# Altium schematic sheet MFX.SchDoc: MFX
size A4; DocumentNumber: MB1167; Revision: B.1; SheetNumber: 16; SheetTotal: 17; Project: STM327x6G-EVAL
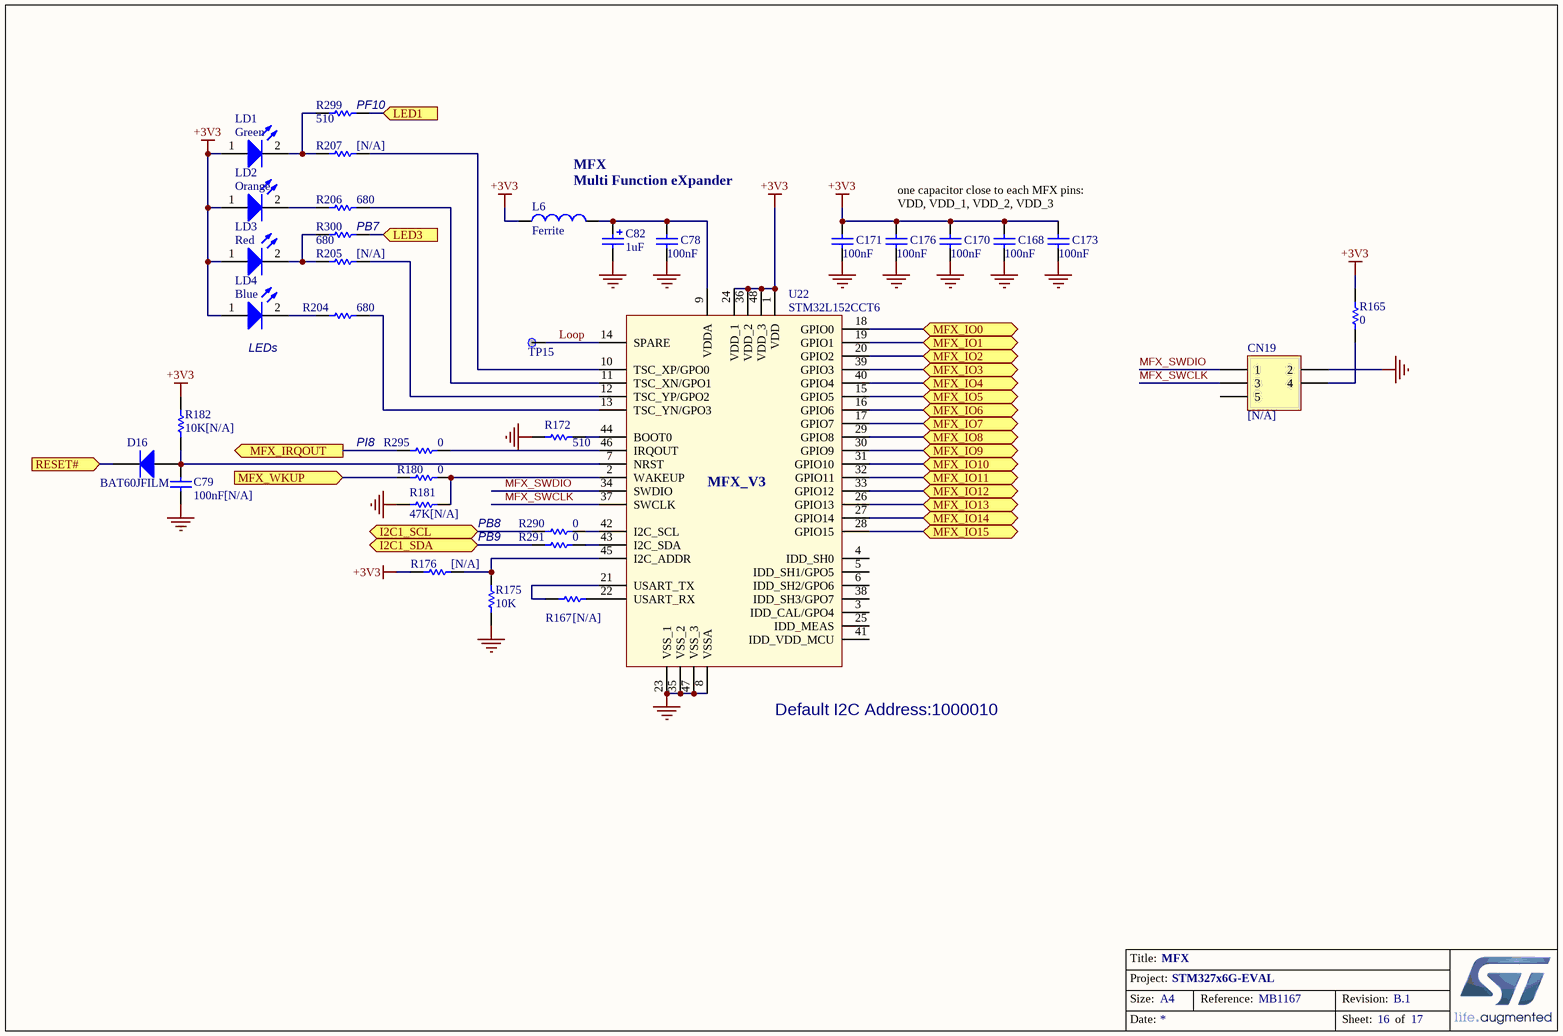
[diagram p0: MFX.SchDoc]

## Parts
C78  100nF  [0402C]
C79  100nF[N/A]  [0402C]
C82  1uF  [TAN-A]
C168  100nF  [0402C]
C170  100nF  [0402C]
C171  100nF  [0402C]
C173  100nF  [0402C]
C176  100nF  [0402C]
CN19  [N/A]  [HDR_2X3-1_2R54-6]
D16  BAT60JFILM  [SOD-323]
L6  Ferrite  [0603L]
LD1  Green  [0603D]
LD2  Orange  [0603D]
LD3  Red  [0603D]
LD4  Blue  [0603D]
R165  0  [0603R]
R167  [N/A]  [0603R]
R172  510  [0402R]
R175  10K  [0402R]
R176  [N/A]  [0603R]
R180  0  [0603R]
R181  47K[N/A]  [0402R]
R182  10K[N/A]  [0402R]
R204  680  [0603R]
R205  [N/A]  [0603R]
R206  680  [0603R]
R207  [N/A]  [0603R]
R290  0  [0603R]
R291  0  [0603R]
R295  0  [0603R]
R299  510  [0603R]
R300  680  [0603R]
TP15  (no value)  [TP]
U22  STM32L152CCT6  [LQFP48_0R5_9X9]

## Ports
I2C1_SCL (bidir), I2C1_SDA (bidir), LED1 (in), LED3 (in), MFX_IO0 (bidir), MFX_IO1 (bidir), MFX_IO2 (bidir), MFX_IO3 (bidir), MFX_IO4 (bidir), MFX_IO5 (bidir), MFX_IO6 (bidir), MFX_IO7 (bidir), MFX_IO8 (bidir), MFX_IO9 (bidir), MFX_IO10 (bidir), MFX_IO11 (bidir), MFX_IO12 (bidir), MFX_IO13 (bidir), MFX_IO14 (bidir), MFX_IO15 (bidir), MFX_IRQOUT (out), MFX_WKUP (in), RESET# (in)

## Nets
+3V3: C168.2 C170.1 C171.2 C173.2 C176.2 L6.1 LD1.1(A) LD2.1(A) LD3.1(A) LD4.1(A) R165.1 R176.2 R182.2 U22.1(VDD) U22.24(VDD_1) U22.36(VDD_2) U22.48(VDD_3)
GND: C78.1 C79.1 C82.2 C168.1 C170.2 C171.1 C173.1 C176.1 CN19.2 R172.2 R175.2 R181.1 U22.8(VSSA) U22.23(VSS_1) U22.35(VSS_2) U22.47(VSS_3)
I2C1_SCL: R290.1 ; port I2C1_SCL
I2C1_SDA: R291.1 ; port I2C1_SDA
LED1: R299.1 ; port LED1
LED3: R300.1 ; port LED3
Loop: TP15.1 U22.14(SPARE)
MFX_IO0: U22.18(GPIO0) ; port MFX_IO0
MFX_IO1: U22.19(GPIO1) ; port MFX_IO1
MFX_IO2: U22.20(GPIO2) ; port MFX_IO2
MFX_IO3: U22.39(GPIO3) ; port MFX_IO3
MFX_IO4: U22.40(GPIO4) ; port MFX_IO4
MFX_IO5: U22.15(GPIO5) ; port MFX_IO5
MFX_IO6: U22.16(GPIO6) ; port MFX_IO6
MFX_IO7: U22.17(GPIO7) ; port MFX_IO7
MFX_IO8: U22.29(GPIO8) ; port MFX_IO8
MFX_IO9: U22.30(GPIO9) ; port MFX_IO9
MFX_IO10: U22.31(GPIO10) ; port MFX_IO10
MFX_IO11: U22.32(GPIO11) ; port MFX_IO11
MFX_IO12: U22.33(GPIO12) ; port MFX_IO12
MFX_IO13: U22.26(GPIO13) ; port MFX_IO13
MFX_IO14: U22.27(GPIO14) ; port MFX_IO14
MFX_IO15: U22.28(GPIO15) ; port MFX_IO15
MFX_IRQOUT: R295.1 ; port MFX_IRQOUT
MFX_SWCLK: CN19.3 U22.37(SWCLK)
MFX_SWDIO: CN19.1 U22.34(SWDIO)
MFX_WKUP: R180.2 ; port MFX_WKUP
RESET#: D16.2(K) ; port RESET#
NetC78_2: C78.2 C82.1 L6.2 U22.9(VDDA)
NetC79_2: C79.2 D16.1(A) R182.1 U22.7(NRST)
NetCN19_4: CN19.4 R165.2
NetLD1_2: LD1.2(K) R207.2 R299.2
NetLD2_2: LD2.2(K) R206.2
NetLD3_2: LD3.2(K) R205.2 R300.2
NetLD4_2: LD4.2(K) R204.2
NetR167_1: R167.1 U22.21(USART_TX)
NetR167_2: R167.2 U22.22(USART_RX)
NetR172_1: R172.1 U22.44(BOOT0)
NetR175_1: R175.1 R176.1 U22.45(I2C_ADDR)
NetR180_1: R180.1 R181.2 U22.2(WAKEUP)
NetR204_1: R204.1 U22.13(TSC_YN/GPO3)
NetR205_1: R205.1 U22.12(TSC_YP/GPO2)
NetR206_1: R206.1 U22.11(TSC_XN/GPO1)
NetR207_1: R207.1 U22.10(TSC_XP/GPO0)
NetR290_2: R290.2 U22.42(I2C_SCL)
NetR291_2: R291.2 U22.43(I2C_SDA)
NetR295_2: R295.2 U22.46(IRQOUT)

Not connected (* = marked no-connect by the designer): CN19 5; U22 3(IDD_CAL/GPO4) 4(IDD_SH0) 5(IDD_SH1/GPO5) 6(IDD_SH2/GPO6) 25(IDD_MEAS) 38(IDD_SH3/GPO7) 41(IDD_VDD_MCU)

## Notes on the sheet
- (near R299) PF10
- (near R300) PB7
- MFX
  Multi Function eXpander
- one capacitor close to each MFX pins: VDD, VDD_1, VDD_2, VDD_3
- (near LD4) LEDs
- PI8
- PB8
- PB9
- (near U22) Default I2C Address:1000010
- Title:
- Project:
- Size:
- Date:
- A4
- Reference:
- Sheet:
- Revision:
- of
- (in symbol MFX) MFX_V3

## Library data of the parts
C78 C79 C168 C170 C171 C173 C176 = Cap_100nF_X7R_10%_0402: Capacitor,100nF,16V,X7R,10%,0402,YAGEO; Manuf_Part_1: CC0402KRX7R7BB104; Revision: July-2002: Re-released for DXP Platform.; Value: 100nF; Order: CC0402KRX7R7BB104; Manuf_1: YAGEO
C82 = Cap_1uF_POL_10%_TANA: Polarized Capacitor,1uF,16V,10%,typeA,AVX; Manuf_Part_1: TAJA105K016R; Revision: July-2002: Re-released for DXP Platform.; Value: 1uF; Order: TAJA105K016R; Manuf_1: AVX; Distrib: *
CN19 = Header 3X2: Header, 3-Pin, Dual row; Revision: 17-Jul-2002: Re-released for DXP Platform.; Publisher: Altium Limited
D16 = Diode: Default Diode; Code - JEDEC: DO-214-AB; Published: 8-Jun-2000; Revision: July-2002: Re-released for DXP Platform.; Publisher: Altium Limited
L6 = BEAD_600R_350MA_0603: Bead,600R,350mA,0603,FCM1608KF-601T03,Tai-tech; Manuf_2: TDK; Manuf_Part_2: MPZ1608S300A; Value: 100uH; Comment_1: bead,30R,5A,0603,MPZ1608S300A,TDK; Revision: July-2002: Re-released for DXP Platform.; Manuf_Part_1: FCM1608KF-601T03; Order: FCM1608KF-601T03; Manuf_1: Tai-tech
LD1-LD4 = LED2: Typical RED, GREEN, YELLOW, AMBER GaAs LED; Published: 8-Jun-2000; Revision: July-2002: Re-released for DXP Platform.; Publisher: Altium Limited
R165 R290 R291 R295 = Res1: Resistor; Value: 1K; Ordered by: Subcon; Published: 8-Jun-2000; Revision: July-2002: Re-released for DXP Platform.; Publisher: Altium Limited
R167 = res1: Resistor; Value: 1K; Ordered by: Subcon; Published: 8-Jun-2000; Revision: July-2002: Re-released for DXP Platform.; Publisher: Altium Limited
R172 R181 R182 = Resistor_ST: Resistor 0402 / 0603 / 0805; Description: Resistor 0402 or 0603 or 0805; Value: 10K
R175 = Resistor_ST: Resistor 0402 / 0603 / 0805; Description: Resistor 0402 or 0603 or 0805; Value: 10K
R176 R180 R204-R207 R299 R300 = Res1: Resistor; Value: 1K; Published: 8-Jun-2000; Revision: July-2002: Re-released for DXP Platform.; Publisher: Altium Limited
TP15 = TP
U22 = MFX: Multifunction expander